# EAGLE schematic capacitive_touch (EAGLE 6.6.0)
AUTHOR: Joshua Adkins; REV: Rev_A; TITLE: Nucleum Touch Sensor
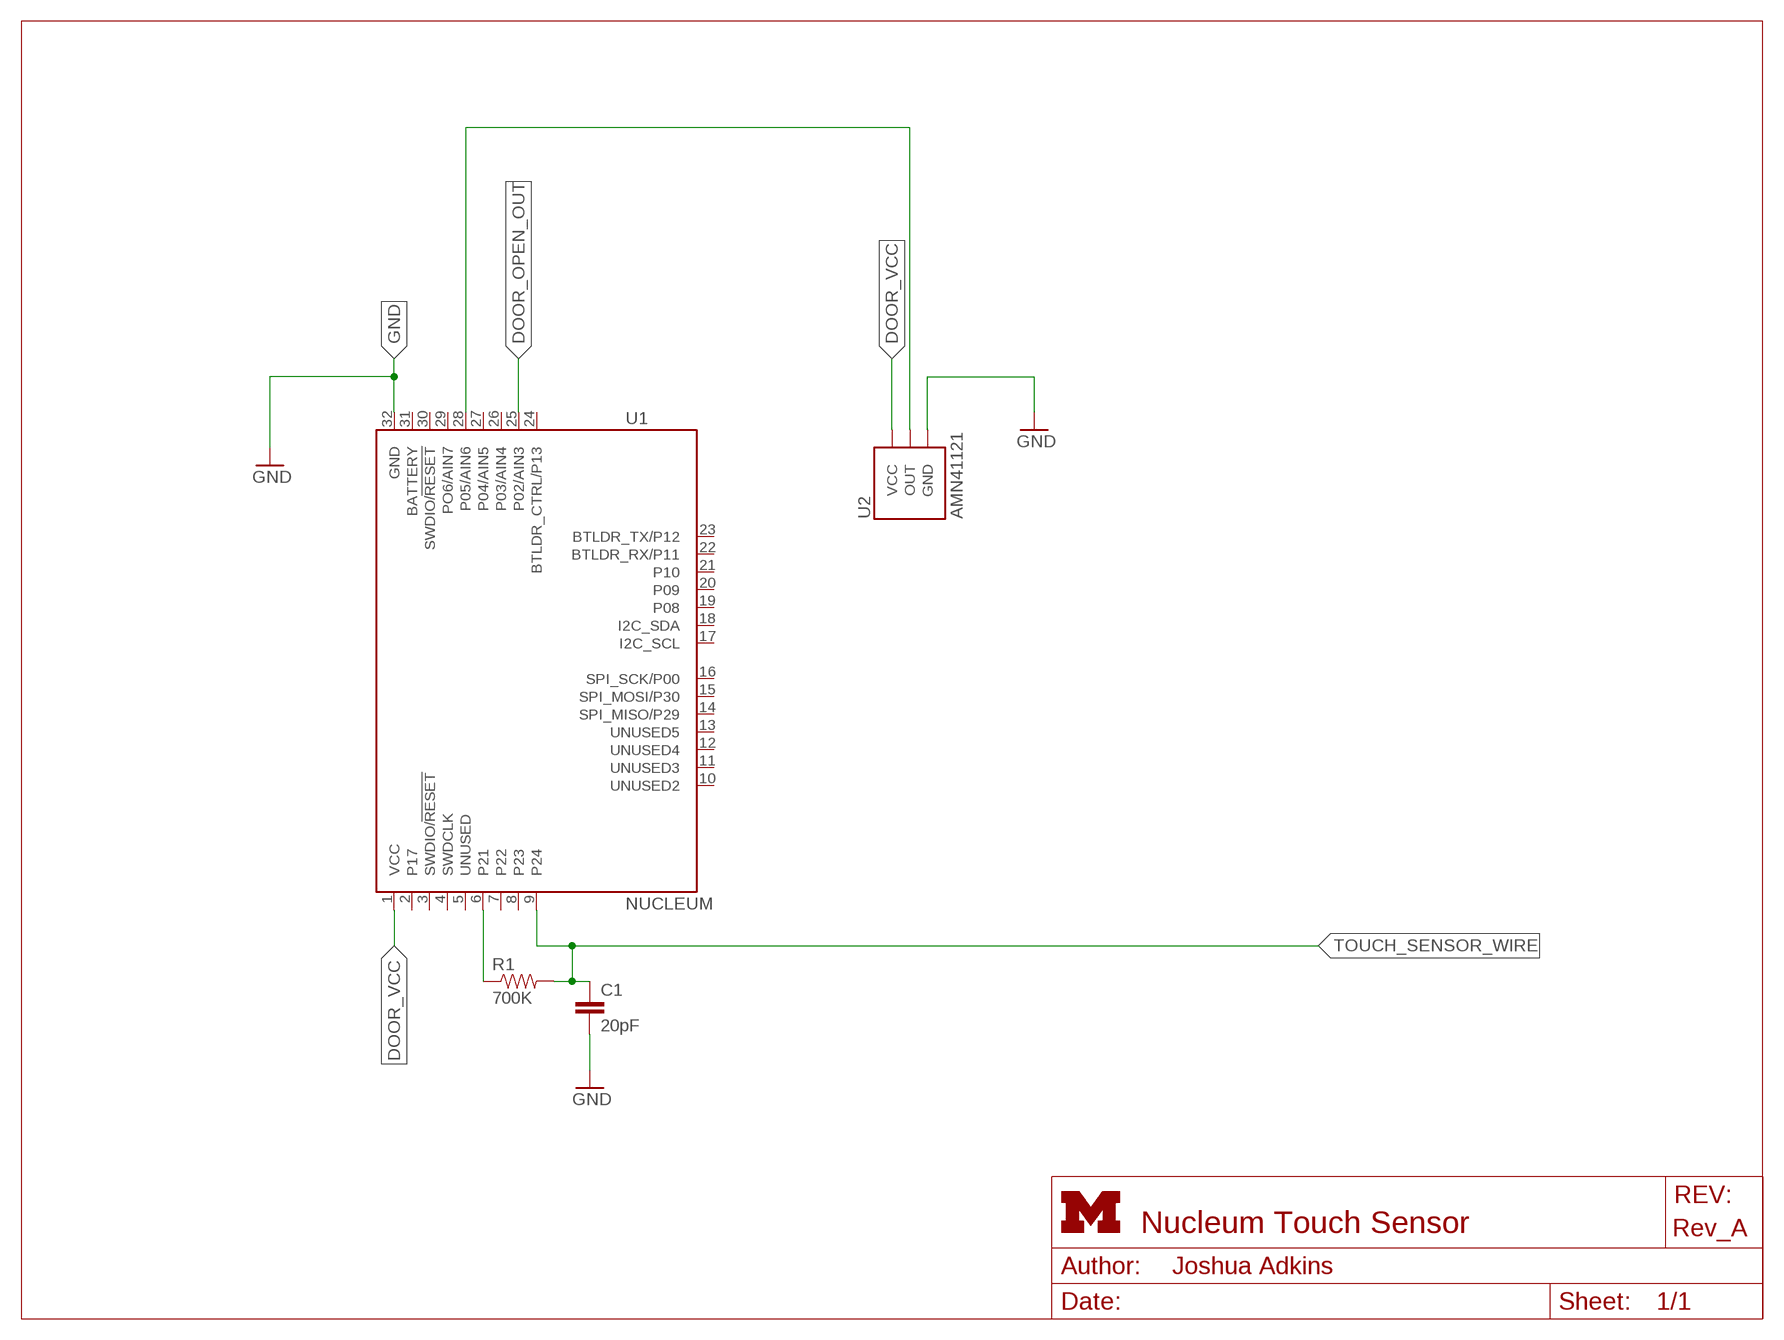
[diagram p0: schematic, sheet 1]
FRAME1 (LETTER_L): HEIGHT: 8.5in; WIDTH: 11in

## Parts
C1  20pF  CAP1206  [1206]
R1  700K  RESISTOR  [0603-RES]
U1  NUCLEUM  [NUCLEUM]
U2  AMN41121  [AMN2]

## Nets
DOOR_OPEN_OUT: U1.25(P02/AIN3)
DOOR_VCC: U1.1(VCC) U2.VCC
GND: C1.2 U1.32(GND) U2.GND
N$3: U1.28(P05/AIN6) U2.OUT
N$4: R1.1 U1.6(P21)
TOUCH_SENSOR_WIRE: C1.1 R1.2 U1.9(P24)
Unconnected: U1.2(P17) U1.3(SWDIO/!RESET) U1.4(SWDCLK) U1.5(UNUSED) U1.7(P22) U1.8(P23) U1.10(UNUSED2) U1.11(UNUSED3) U1.12(UNUSED4) U1.13(UNUSED5) U1.14(SPI_MISO/P29) U1.15(SPI_MOSI/P30) U1.16(SPI_SCK/P00) U1.17(I2C_SCL) U1.18(I2C_SDA) U1.19(P08) U1.20(P09) U1.21(P10) U1.22(BTLDR_RX/P11) U1.23(BTLDR_TX/P12) U1.24(BTLDR_CTRL/P13) U1.26(P03/AIN4) U1.27(P04/AIN5) U1.29(PO6/AIN7) U1.30(SWDIO/!RESET) U1.31(BATTERY)

## Library data of the parts
C1 = SparkFun-Passives:CAP: Capacitor Standard 0603 ceramic capacitor, and 0.1" leaded capacitor.
R1 = passives:RESISTOR: Resistor Basic schematic elements and footprints for 0603, 1206, and PTH resistors.
U1 = nucleum:NUCLEUM: Nucleum sensorboard prototyping module.
U2 = chips:AMN: Passive infrared human detection sensor with built-in amp.; DIGIKEY: 255-2651-ND